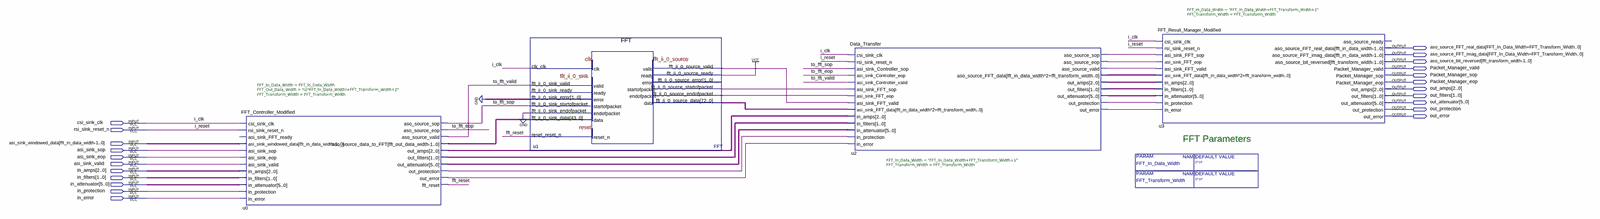
[diagram p0: schematic sheet, whole]
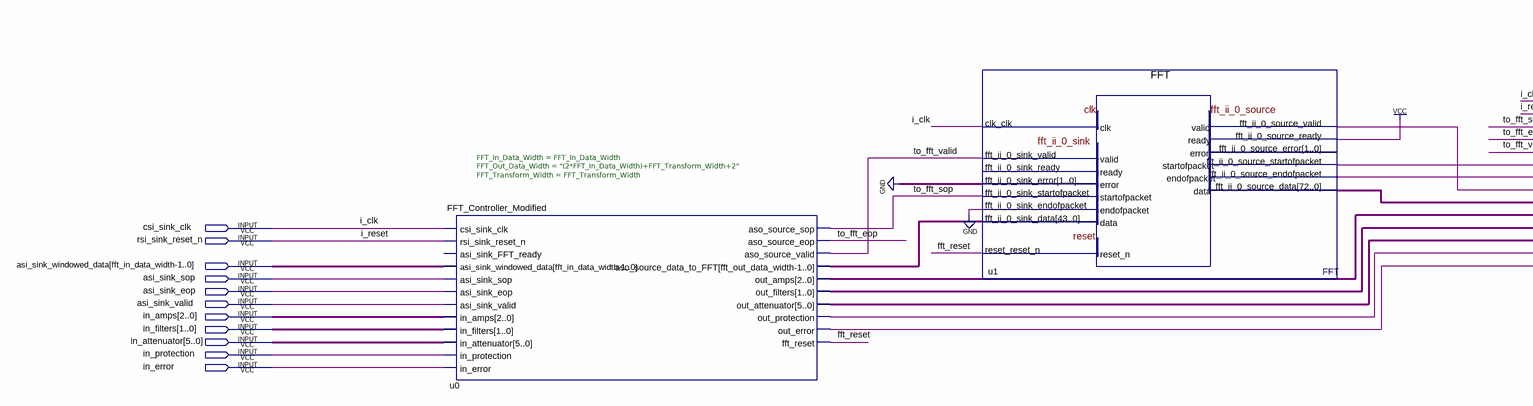
[diagram p1: schematic sheet, left part]
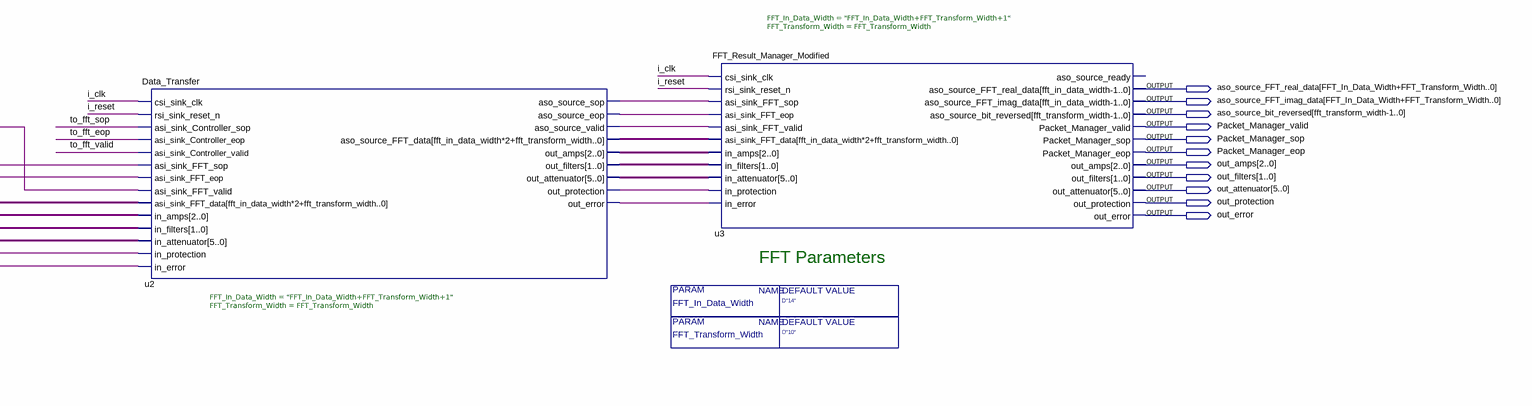
[diagram p2: schematic sheet, right part]
// Quartus schematic fft_top.bdf as structural Verilog: 4 symbols, 22 pins
module fft_top #(parameter FFT_Transform_Width = "D\"10\"", parameter FFT_In_Data_Width = "D\"14\"") (
  input  csi_sink_clk,
  input  rsi_sink_reset_n,
  input  \asi_sink_windowed_data[fft_in_data_width-1..0] ,
  input  asi_sink_sop,
  input  asi_sink_eop,
  input  asi_sink_valid,
  input  [2:0] in_amps,
  input  [1:0] in_filters,
  input  [5:0] in_attenuator,
  input  in_protection,
  input  in_error,
  output \aso_source_FFT_real_data[FFT_In_Data_Width+FFT_Transform_Width..0] ,
  output \aso_source_FFT_imag_data[FFT_In_Data_Width+FFT_Transform_Width..0] ,
  output \aso_source_bit_reversed[fft_transform_width-1..0] ,
  output Packet_Manager_valid,
  output Packet_Manager_sop,
  output Packet_Manager_eop,
  output [2:0] out_amps,
  output [1:0] out_filters,
  output [5:0] out_attenuator,
  output out_protection,
  output out_error
);

  wire fft_reset, to_fft_eop, to_fft_sop, to_fft_valid, u0_out_error, u0_out_protection,
       u1_fft_ii_0_source_endofpacket, u1_fft_ii_0_source_startofpacket, u1_fft_ii_0_source_valid,
       u2_aso_source_eop, u2_aso_source_fft_data, u2_aso_source_sop, u2_aso_source_valid, u2_out_error,
       u2_out_protection;
  wire [1:0] u0_out_filters, u2_out_filters;
  wire [2:0] u0_out_amps, u2_out_amps;
  wire [5:0] u0_out_attenuator, u2_out_attenuator;
  wire [43:0] u0_aso_source_data_to_fft;
  wire [72:0] u1_fft_ii_0_source_data;

  FFT_Controller_Modified #(.FFT_In_Data_Width(FFT_In_Data_Width), .FFT_Out_Data_Width("(2*FFT_In_Data_Width)+FFT_Transform_Width+2"), .FFT_Transform_Width(FFT_Transform_Width)) u0 (
    .csi_sink_clk(csi_sink_clk), .rsi_sink_reset_n(rsi_sink_reset_n),
    .asi_sink_windowed_data(\asi_sink_windowed_data[fft_in_data_width-1..0] ), .asi_sink_sop(asi_sink_sop),
    .asi_sink_eop(asi_sink_eop), .asi_sink_valid(asi_sink_valid), .in_amps(in_amps), .in_filters(in_filters),
    .in_attenuator(in_attenuator), .in_protection(in_protection), .in_error(in_error),
    .aso_source_sop(to_fft_sop), .aso_source_eop(to_fft_eop), .aso_source_valid(to_fft_valid),
    .aso_source_data_to_FFT(u0_aso_source_data_to_fft), .out_amps(u0_out_amps), .out_filters(u0_out_filters),
    .out_attenuator(u0_out_attenuator), .out_protection(u0_out_protection), .out_error(u0_out_error),
    .fft_reset(fft_reset));  // open: asi_sink_FFT_ready
  FFT u1 (
    .clk_clk(csi_sink_clk), .fft_ii_0_sink_valid(to_fft_valid), .fft_ii_0_sink_error(2'b00),
    .fft_ii_0_sink_startofpacket(to_fft_sop), .fft_ii_0_sink_endofpacket(1'b0),
    .fft_ii_0_sink_data(u0_aso_source_data_to_fft), .fft_ii_0_source_ready(1'b1), .reset_reset_n(fft_reset),
    .fft_ii_0_source_valid(u1_fft_ii_0_source_valid),
    .fft_ii_0_source_startofpacket(u1_fft_ii_0_source_startofpacket),
    .fft_ii_0_source_endofpacket(u1_fft_ii_0_source_endofpacket),
    .fft_ii_0_source_data(u1_fft_ii_0_source_data));  // open: fft_ii_0_sink_ready, fft_ii_0_source_error
  Data_Transfer #(.FFT_In_Data_Width("FFT_In_Data_Width+FFT_Transform_Width+1"), .FFT_Transform_Width(FFT_Transform_Width)) u2 (
    .csi_sink_clk(csi_sink_clk), .rsi_sink_reset_n(rsi_sink_reset_n), .asi_sink_Controller_sop(to_fft_sop),
    .asi_sink_Controller_eop(to_fft_eop), .asi_sink_Controller_valid(to_fft_valid),
    .asi_sink_FFT_sop(u1_fft_ii_0_source_startofpacket), .asi_sink_FFT_eop(u1_fft_ii_0_source_endofpacket),
    .asi_sink_FFT_valid(u1_fft_ii_0_source_valid), .asi_sink_FFT_data(u1_fft_ii_0_source_data),
    .in_amps(u0_out_amps), .in_filters(u0_out_filters), .in_attenuator(u0_out_attenuator),
    .in_protection(u0_out_protection), .in_error(u0_out_error), .aso_source_sop(u2_aso_source_sop),
    .aso_source_eop(u2_aso_source_eop), .aso_source_valid(u2_aso_source_valid),
    .aso_source_FFT_data(u2_aso_source_fft_data), .out_amps(u2_out_amps), .out_filters(u2_out_filters),
    .out_attenuator(u2_out_attenuator), .out_protection(u2_out_protection), .out_error(u2_out_error));
  FFT_Result_Manager_Modified #(.FFT_In_Data_Width("FFT_In_Data_Width+FFT_Transform_Width+1"), .FFT_Transform_Width(FFT_Transform_Width)) u3 (
    .csi_sink_clk(csi_sink_clk), .rsi_sink_reset_n(rsi_sink_reset_n), .asi_sink_FFT_sop(u2_aso_source_sop),
    .asi_sink_FFT_eop(u2_aso_source_eop), .asi_sink_FFT_valid(u2_aso_source_valid),
    .asi_sink_FFT_data(u2_aso_source_fft_data), .in_amps(u2_out_amps), .in_filters(u2_out_filters),
    .in_attenuator(u2_out_attenuator), .in_protection(u2_out_protection), .in_error(u2_out_error),
    .aso_source_FFT_real_data(\aso_source_FFT_real_data[FFT_In_Data_Width+FFT_Transform_Width..0] ),
    .aso_source_FFT_imag_data(\aso_source_FFT_imag_data[FFT_In_Data_Width+FFT_Transform_Width..0] ),
    .aso_source_bit_reversed(\aso_source_bit_reversed[fft_transform_width-1..0] ),
    .Packet_Manager_valid(Packet_Manager_valid), .Packet_Manager_sop(Packet_Manager_sop),
    .Packet_Manager_eop(Packet_Manager_eop), .out_amps(out_amps), .out_filters(out_filters),
    .out_attenuator(out_attenuator), .out_protection(out_protection), .out_error(out_error));  // open: aso_source_ready

  // Other names for the same wires on the sheet: i_clk = csi_sink_clk; i_reset = rsi_sink_reset_n

  // Notes on the sheet:
  //   FFT Parameters
endmodule
